# EAGLE design schemat (EAGLE 9.3.0)
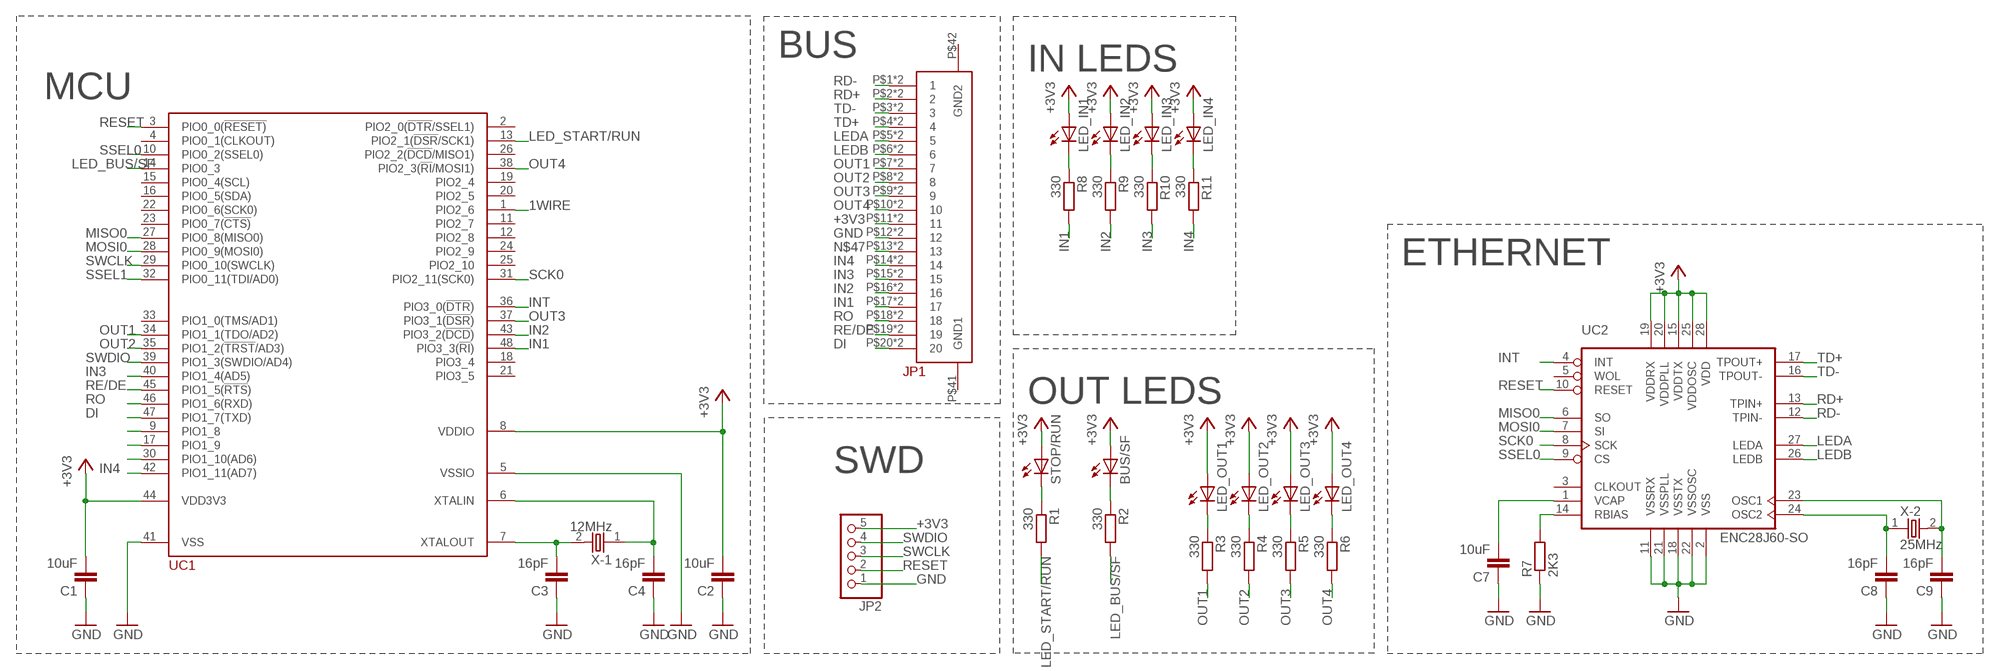
[diagram p0: schematic, sheet 1]

## Parts
BUS/SF  LED3MM  [LED3MM]
C1  10uF  C-0805  [C0805]
C2  10uF  C-0805  [C0805]
C3  16pF  C-0805  [C0805]
C4  16pF  C-0805  [C0805]
C7  10uF  C-0805  [C0805]
C8  16pF  C-0805  [C0805]
C9  16pF  C-0805  [C0805]
JP1  FFC(FPC)_ZIF_20_PINV  [PCA-2C-20-V-3]
JP2  PINHD-1X5  [1X05]
LED_IN1  LED3MM  [LED3MM]
LED_IN2  LED3MM  [LED3MM]
LED_IN3  LED3MM  [LED3MM]
LED_IN4  LED3MM  [LED3MM]
LED_OUT1  LED3MM  [LED3MM]
LED_OUT2  LED3MM  [LED3MM]
LED_OUT3  LED3MM  [LED3MM]
LED_OUT4  LED3MM  [LED3MM]
R1  330  R-0805W  [R0805W]
R2  330  R-0805W  [R0805W]
R3  330  R-0805W  [R0805W]
R4  330  R-0805W  [R0805W]
R5  330  R-0805W  [R0805W]
R6  330  R-0805W  [R0805W]
R7  2K3  R-0805  [R0805]
R8  330  R-0805W  [R0805W]
R9  330  R-0805W  [R0805W]
R10  330  R-0805W  [R0805W]
R11  330  R-0805W  [R0805W]
STOP/RUN  LED3MM  [LED3MM]
UC1  NXP-LPC111X  [LQFP48]
UC2  ENC28J60-SO  [SO28W]
X-1  12MHz  CRISTAL_SMD  [HC49UP]
X-2  25MHz  CRISTAL_SMD  [HC49UP]

## Nets
1WIRE: UC1.1(PIO2_6)
+3V3: BUS/SF.A C1.2 C2.2 JP1.P$11 JP1.P$31 JP2.5 LED_IN1.A LED_IN2.A LED_IN3.A LED_IN4.A LED_OUT1.A LED_OUT2.A LED_OUT3.A LED_OUT4.A STOP/RUN.A UC1.8(VDDIO) UC1.44(VDD3V3) UC2.15(VDDTX) UC2.19(VDDRX) UC2.20(VDDPLL) UC2.25(VDDOSC) UC2.28(VDD)
DI: JP1.P$20 JP1.P$40 UC1.47(PIO1_7(TXD))
GND: C1.1 C2.1 C3.1 C4.1 C7.1 C8.1 C9.1 JP1.P$12 JP1.P$32 JP2.1 R7.1 UC1.5(VSSIO) UC1.41(VSS) UC2.2(VSS) UC2.11(VSSRX) UC2.18(VSSTX) UC2.21(VSSPLL) UC2.22(VSSOSC)
IN1: JP1.P$17 JP1.P$37 R8.2 UC1.48(PIO3_3(!RI!))
IN2: JP1.P$16 JP1.P$36 R9.2 UC1.43(PIO3_2(!DCD!))
IN3: JP1.P$15 JP1.P$35 R10.2 UC1.40(PIO1_4(AD5))
IN4: JP1.P$14 JP1.P$34 R11.2 UC1.42(PIO1_11(AD7))
INT: UC1.36(PIO3_0(!DTR!)) UC2.4(INT)
LED_BUS/SF: R2.2 UC1.14(PIO0_3)
LED_START/RUN: R1.2 UC1.13(PIO2_1(!DSR!/SCK1))
LEDA: JP1.P$5 JP1.P$25 UC2.27(LEDA)
LEDB: JP1.P$6 JP1.P$26 UC2.26(LEDB)
MISO0: UC1.27(PIO0_8(MISO0)) UC2.6(SO)
MOSI0: UC1.28(PIO0_9(MOSI0)) UC2.7(SI)
N$1: C3.2 UC1.7(XTALOUT) X-1.2
N$2: C4.2 UC1.6(XTALIN) X-1.1
N$3: C8.2 UC2.24(OSC2) X-2.1
N$4: R1.1 STOP/RUN.K(C)
N$5: LED_IN4.K(C) R11.1
N$6: BUS/SF.K(C) R2.1
N$7: LED_OUT4.K(C) R6.1
N$8: LED_IN1.K(C) R8.1
N$9: LED_IN2.K(C) R9.1
N$10: LED_IN3.K(C) R10.1
N$11: LED_OUT3.K(C) R5.1
N$12: LED_OUT2.K(C) R4.1
N$13: LED_OUT1.K(C) R3.1
N$14: UC1.30(PIO1_10(AD6))
N$15: UC1.17(PIO1_9)
N$16: UC1.9(PIO1_8)
N$27: C9.2 UC2.23(OSC1) X-2.2
N$28: C7.2 UC2.1(VCAP)
N$30: R7.2 UC2.14(RBIAS)
N$47: JP1.P$13 JP1.P$33
OUT1: JP1.P$7 JP1.P$27 R3.2 UC1.34(PIO1_1(TDO/AD2))
OUT2: JP1.P$8 JP1.P$28 R4.2 UC1.35(PIO1_2(!TRST!/AD3))
OUT3: JP1.P$9 JP1.P$29 R5.2 UC1.37(PIO3_1(!DSR!))
OUT4: JP1.P$10 JP1.P$30 R6.2 UC1.38(PIO2_3(!RI!/MOSI1))
RD+: JP1.P$2 JP1.P$22 UC2.13(TPIN+)
RD-: JP1.P$1 JP1.P$21 UC2.12(TPIN-)
RE/DE: JP1.P$19 JP1.P$39 UC1.45(PIO1_5(!RTS!))
RESET: JP2.2 UC1.3(PIO0_0(!RESET)) UC2.10(RESET)
RO: JP1.P$18 JP1.P$38 UC1.46(PIO1_6(RXD))
SCK0: UC1.31(PIO2_11(SCK0)) UC2.8(SCK)
SSEL0: UC1.10(PIO0_2(SSEL0)) UC2.9(CS)
SSEL1: UC1.32(PIO0_11(TDI/AD0))
SWCLK: JP2.3 UC1.29(PIO0_10(SWCLK))
SWDIO: JP2.4 UC1.39(PIO1_3(SWDIO/AD4))
TD+: JP1.P$4 JP1.P$24 UC2.17(TPOUT+)
TD-: JP1.P$3 JP1.P$23 UC2.16(TPOUT-)
Unconnected: JP1.P$41(GND1) JP1.P$42(GND2) UC1.2(PIO2_0(!DTR!/SSEL1)) UC1.4(PIO0_1(CLKOUT)) UC1.11(PIO2_7) UC1.12(PIO2_8) UC1.15(PIO0_4(SCL)) UC1.16(PIO0_5(SDA)) UC1.18(PIO3_4) UC1.19(PIO2_4) UC1.20(PIO2_5) UC1.21(PIO3_5) UC1.22(PIO0_6(SCK0)) UC1.23(PIO0_7(!CTS)) UC1.24(PIO2_9) UC1.25(PIO2_10) UC1.26(PIO2_2(!DCD!/MISO1)) UC1.33(PIO1_0(TMS/AD1)) UC2.3(CLKOUT) UC2.5(WOL)

## Notes on the sheet
- BUS
- IN LEDS
- MCU
- ETHERNET
- OUT LEDS
- SWD

## Library data of the parts
BUS/SF LED_IN1-LED_IN4 LED_OUT1-LED_OUT4 STOP/RUN = led:LED: LED OSRAM: - CHIPLED LG R971, LG N971, LY N971, LG Q971, LY Q971, LO R971, LY R971 LH N974, LH R974 LS Q976, LO Q976, LY Q976 LO Q996 - Hyper CHIPLED LW Q18S LB Q993, LB Q99A, LB R99A - SideLED LS A670, LO A670, LY A670, LG A670, LP A670 LB A673, LV A673, LT A673, LW A673 LH A674 LY A675 LS A676, LA A676, LO A676, LY A676, LW A676 LS A679, LY A679, LG A679 - Hyper Micro SIDELED® LS Y876, LA Y876, LO Y876, LY Y876 LT Y87S - SmartLED LW L88C, LW L88S LB L89C, LB L89S, LG L890 LS L89K, LO L89K, LY L89K LS L896, LA L896, LO L896, LY L896 - TOPLED LS T670, LO T670, LY T670, LG T670, LP T670 LSG T670, LSP T670, LSY T670, LOP T670, LYG T670 LG T671, LOG T671, LSG T671 LB T673, LV T673, LT T673, LW T673 LH T674 LS T676, LA T676, LO T676, LY T676, LB T676, LH T676, LSB T676, LW T676 LB T67C, LV T67C, LT T67C, LS T67K, LO T67K, LY T67K, LW E67C LS E67B, LA E67B, LO E67B, LY E67B, LB E67C, LV E67C, LT E67C LW T67C LS T679, LY T679, LG T679 LS T770, LO T770, LY T770, LG T770, LP T770 LB T773, LV T773, LT T773, LW T773 LH T774 LS E675, LA E675, LY E675, LS T675 LS T776, LA T776, LO T776, LY T776, LB T776 LHGB T686 LT T68C, LB T68C - Hyper Mini TOPLED® LB M676 - Mini TOPLED Santana® LG M470 LS M47K, LO M47K, LY M47K Source: http://www.osram.convergy.de LUXEON: - LUMILED® LXK2-PW12-R00, LXK2-PW12-S00, LXK2-PW14-U00, LXK2-PW14-V00 LXK2-PM12-R00, LXK2-PM12-S00, LXK2-PM14-U00 LXK2-PE12-Q00, LXK2-PE12-R00, LXK2-PE12-S00, LXK2-PE14-T00, LXK2-PE14-U00 LXK2-PB12-K00, LXK2-PB12-L00, LXK2-PB12-M00, LXK2-PB14-N00, LXK2-PB14-P00, LXK2-PB14-Q00 LXK2-PR12-L00, LXK2-PR12-M00, LXK2-PR14-Q00, LXK2-PR14-R00 LXK2-PD12-Q00, LXK2-PD12-R00, LXK2-PD12-S00 LXK2-PH12-R00, LXK2-PH12-S00 LXK2-PL12-P00, LXK2-PL12-Q00, LXK2-PL12-R00 Source: www.luxeon.com KINGBRIGHT: KA-3528ASYC Source: www.kingbright.com
C1-C4 C7-C9 = devport001:C-0805: Kondensator SMD w obudowie 0805
JP1 = devport001:FFC(FPC)_ZIF_20_PIN
JP2 = pinhead:PINHD-1X5: PIN HEADER
R1-R11 = devport001:R-0805: Rezystor SMD w obudowie 0805
UC1 = devport001:NXP-LPC111X: NXP LPC111X
UC2 = enc28j60:ENC28J60-*: Microchip 10Mbit Ethernet controller with SPI interface Improved SOIC28 layout (pads in 0.01 raster, pin1 slightly smaller). Pin 6 (SO) changed from Out (paralleling several Outs gives an error) to OC. Author: Profi from mikrocontroller.net - forum Date: 2006.0827
X-1 X-2 = devport001:CRISTAL

## Board
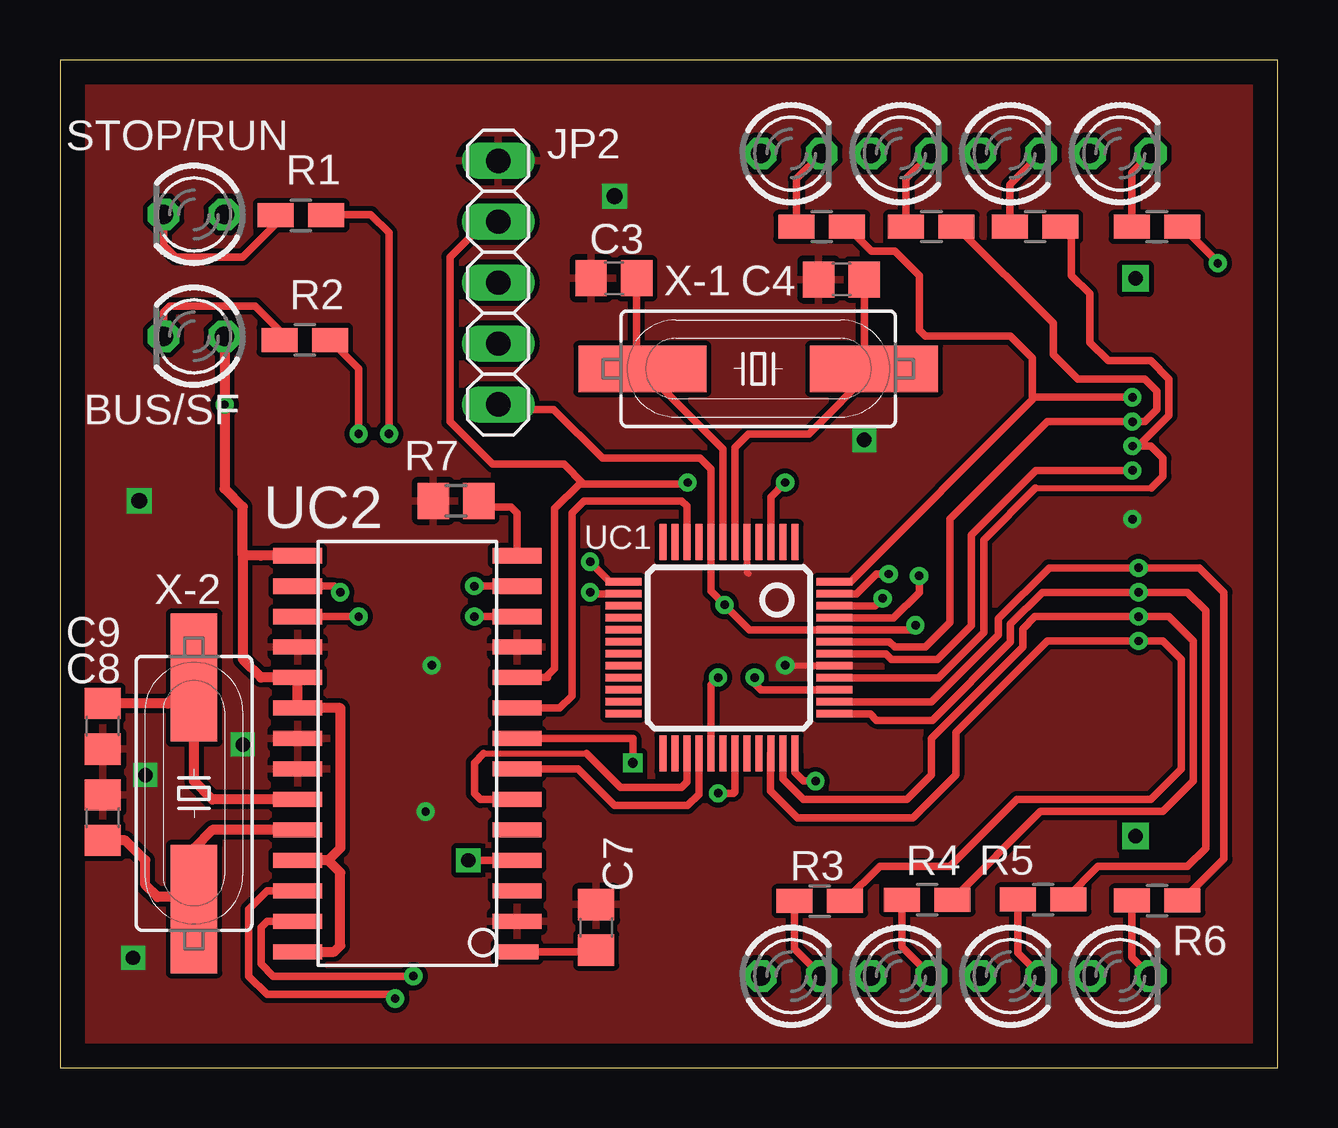
[diagram p1: board, top side]
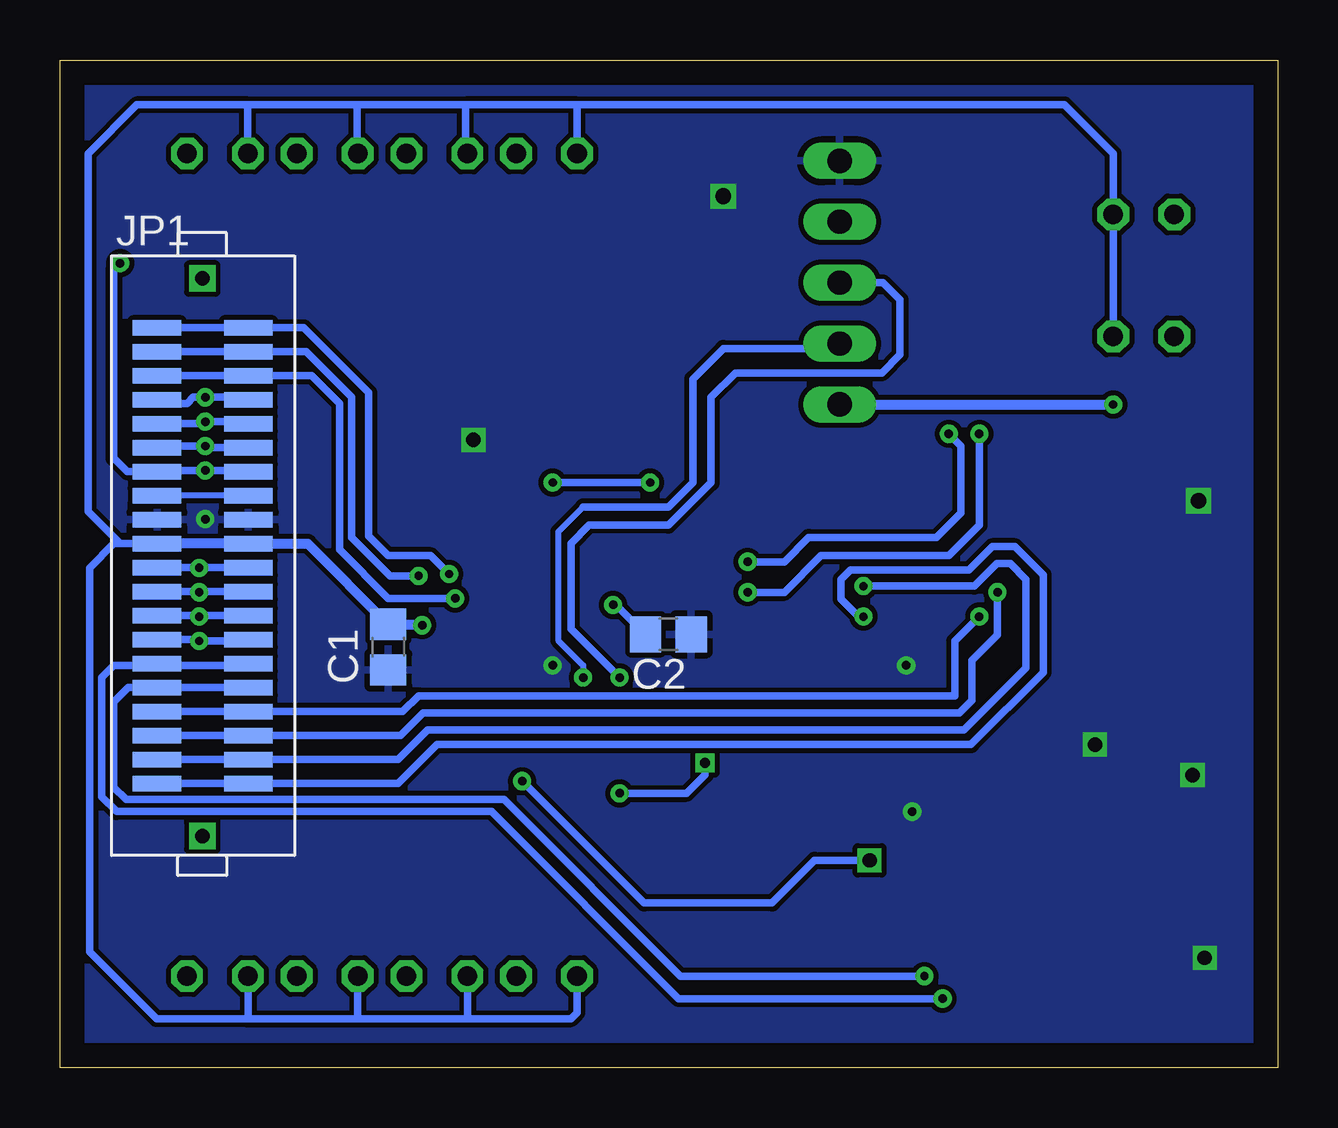
[diagram p2: board, bottom side, seen from below]

Size 50.76 x 42 mm. Coordinates in mm from the lower left corner, seen from the top.
Outline: 0,0 50.76,0 50.76,42 0,42 0,0
Copper layers (1*16): Top 0.035mm / dielectric 1.5mm / Bottom 0.035mm
Design rules "default *": minimum track width 10mil, minimum drill 0.35mm, track to track 8mil, track to pad 8mil, pad to pad 8mil, via to via 8mil, smd to smd 8mil, copper to edge 40mil, drill to drill 10mil, minimum pad ring 10mil, minimum via ring 8mil, stop-mask expansion 4mil, vias tented up to drill 0mil, thermal gap 10mil

### Footprints (pad centres in the part's own frame; a part is rotated, then mirrored left to right if it is on the bottom)
LED3MM = drill 0.813 octagon: A -1.27,0; K 1.27,0
C0805 = smd 1.3 x 1.5: 1 -0.95,0; 2 0.95,0
PCA-2C-20-V-3 = smd 2.032 x 0.635: P$1 -1.54,9.5; P$2 -1.54,8.5; P$3 -1.54,7.5; P$4 -1.54,6.5; P$5 -1.54,5.5; P$6 -1.54,4.5; P$7 -1.54,3.5; P$8 -1.54,2.5; P$9 -1.54,1.5; P$10 -1.54,0.5; P$11 -1.54,-0.5; P$12 -1.54,-1.5; P$13 -1.54,-2.5; P$14 -1.54,-3.5; P$15 -1.54,-4.5; P$16 -1.54,-5.5; P$17 -1.54,-6.5; P$18 -1.54,-7.5; P$19 -1.54,-8.5; P$20 -1.54,-9.5; P$21 2.27,9.5; P$22 2.27,8.5; P$23 2.27,7.5; P$24 2.27,6.5; P$25 2.27,5.5; P$26 2.27,4.5; P$27 2.27,3.5; P$28 2.27,2.5; P$29 2.27,1.5; P$30 2.27,0.5; P$31 2.27,-0.5; P$32 2.27,-1.5; P$33 2.27,-2.5; P$34 2.27,-3.5; P$35 2.27,-4.5; P$36 2.27,-5.5; P$37 2.27,-6.5; P$38 2.27,-7.5; P$39 2.27,-8.5; P$40 2.27,-9.5 | drill 0.6 square: P$41 0.381,11.684; P$42 0.381,-11.557
1X05 = drill 1.016 long: 1 -5.08,0; 2 -2.54,0; 3 0,0; 4 2.54,0; 5 5.08,0
R0805W = smd 1.5 x 1: 1 -1.052,0; 2 1.052,0
R0805 = smd 1.3 x 1.5: 1 -0.95,0; 2 0.95,0
LQFP48 = smd 0.3 x 1.5: 1 -2.75,-4.4; 2 -2.25,-4.4; 3 -1.75,-4.4; 4 -1.25,-4.4; 5 -0.75,-4.4; 6 -0.25,-4.4; 7 0.25,-4.4; 8 0.75,-4.4; 9 1.25,-4.4; 10 1.75,-4.4; 11 2.25,-4.4; 12 2.75,-4.4; 25 2.75,4.4; 26 2.25,4.4; 27 1.75,4.4; 28 1.25,4.4; 29 0.75,4.4; 30 0.25,4.4; 31 -0.25,4.4; 32 -0.75,4.4; 33 -1.25,4.4; 34 -1.75,4.4; 35 -2.25,4.4; 36 -2.75,4.4 | smd 1.5 x 0.3: 13 4.4,-2.75; 14 4.4,-2.25; 15 4.4,-1.75; 16 4.4,-1.25; 17 4.4,-0.75; 18 4.4,-0.25; 19 4.4,0.25; 20 4.4,0.75; 21 4.4,1.25; 22 4.4,1.75; 23 4.4,2.25; 24 4.4,2.75; 37 -4.4,2.75; 38 -4.4,2.25; 39 -4.4,1.75; 40 -4.4,1.25; 41 -4.4,0.75; 42 -4.4,0.25; 43 -4.4,-0.25; 44 -4.4,-0.75; 45 -4.4,-1.25; 46 -4.4,-1.75; 47 -4.4,-2.25; 48 -4.4,-2.75
SO28W = smd 0.635 x 1.778: 1 -7.62,-4.572 | smd 0.635 x 2.032: 2 -6.35,-4.572; 3 -5.08,-4.572; 4 -3.81,-4.572; 5 -2.54,-4.572; 6 -1.27,-4.572; 7 0,-4.572; 8 1.27,-4.572; 9 2.54,-4.572; 10 3.81,-4.572; 11 5.08,-4.572; 12 6.35,-4.572; 13 7.62,-4.572; 14 8.89,-4.572; 15 8.89,4.572; 16 7.62,4.572; 17 6.35,4.572; 18 5.08,4.572; 19 3.81,4.572; 20 2.54,4.572; 21 1.27,4.572; 22 0,4.572; 23 -1.27,4.572; 24 -2.54,4.572; 25 -3.81,4.572; 26 -5.08,4.572; 27 -6.35,4.572; 28 -7.62,4.572
HC49UP = smd 5.334 x 1.93: 1 -4.826,0; 2 4.826,0

### Placement (x,y rotation side)
BUS/SF  5.59,30.48 180 top
C1  37.08,17.53 90 bottom
C2  25.4,18.06 180 bottom
C3  23.09,32.9 0 top
C4  32.57,32.85 0 top
C7  22.35,5.84 270 top
C8  1.78,10.41 270 top
C9  1.78,14.22 90 top
JP1  44.45,21.34 180 bottom
JP2  18.27,32.72 270 top
LED_IN1  30.48,38.1 0 top
LED_IN2  35.05,38.1 0 top
LED_IN3  39.62,38.1 0 top
LED_IN4  44.2,38.1 0 top
LED_OUT1  30.48,3.81 0 top
LED_OUT2  35.05,3.81 0 top
LED_OUT3  39.62,3.81 0 top
LED_OUT4  44.2,3.81 0 top
R1  10.05,35.53 0 top
R2  10.2,30.32 0 top
R3  31.67,6.94 0 top
R4  36.15,7 0 top
R5  40.98,7.01 0 top
R6  45.73,6.96 0 top
R7  16.51,23.62 0 top
R8  31.75,35.05 0 top
R9  36.32,35.05 0 top
R10  40.64,35.05 0 top
R11  45.72,35.05 0 top
STOP/RUN  5.59,35.56 180 top
UC1  27.88,17.5 180 top
UC2  14.48,12.45 90 top
X-1  29.1,29.13 180 top
X-2  5.59,11.43 90 top

### Tracks (layer width: path | path; a pad name or v marks a point on that pad's centre or on a via)
+3V3  (via drill 0.35)
  Top 0.305: JP2.5 18.47,27.43 20.57,27.43 22.61,25.4 26.67,25.4 27.13,24.94 UC1.8 27.13,19.86 v27.7,19.29 28.74,18.25 UC1.44 35.47,18.25 v35.66,18.44
  Top 0.406: UC2.28 11.43,4.83 11.68,5.08 11.68,8.13 11.18,8.64 | 11.18,8.64 11.68,9.14 11.68,14.99 UC2.20 UC2.19 8.38,16.26 7.62,17.02 7.62,21.34 | 11.18,8.64 UC2.25 | UC2.15 8.38,21.34 7.62,21.34 | BUS/SF.A v6.86,27.63 6.86,24.13 7.62,23.37 7.62,21.34
  Bottom 0.305: BUS/SF.A STOP/RUN.A 6.86,38.1 8.89,40.13 29.16,40.13 29.21,40.13 | C2.2 27.58,19.29 v27.7,19.29 | JP1.P$31 48.26,21.84 | 48.26,21.84 48.52,21.84 49.53,20.83 49.53,4.83 46.74,2.03 43.02,2.03 | 38.29,2.03 33.74,2.03 | 43.02,2.03 38.29,2.03 | 33.74,2.03 29.46,2.03 29.21,2.29 LED_OUT1.A | LED_OUT2.A 33.78,2.08 33.74,2.03 | LED_OUT3.A 38.35,2.09 38.29,2.03 | LED_OUT4.A 42.93,2.13 43.02,2.03 | 48.26,21.84 49.59,23.17 49.59,38.1 47.56,40.13 42.94,40.13 | 38.37,40.13 33.85,40.13 | 42.94,40.13 38.37,40.13 | LED_IN2.A 33.85,38.17 33.85,40.13 | LED_IN3.A 38.37,38.12 38.37,40.13 | LED_IN4.A 42.94,38.12 42.94,40.13 | 29.21,40.13 33.85,40.13 | LED_IN1.A 29.21,40.13
  Bottom 0.406: JP2.5 v6.86,27.63 | JP1.P$31 JP1.P$11 40.44,21.84 C1.2 35.7,18.48 v35.66,18.44
DI  (via drill 0.35)
  Top 0.305: UC1.47 33.21,19.75 34.04,20.57 v34.54,20.57
  Bottom 0.305: v34.54,20.57 35.31,21.34 37.08,21.34 37.9,22.15 37.9,28.13 40.6,30.84 JP1.P$20 JP1.P$40
GND  (via drill 0.35, 0.6, 0.65)
  Top 0.254: UC1.41 30.24,16.75 v30.23,16.76 | UC1.5 28.63,20.64 28.7,20.57
  other vias: 3.3,23.62 23.11,36.32 3.56,12.19 7.62,13.46 33.53,26.16 3.05,4.57 15.49,16.76 15.24,10.67 44.7,22.86
  pour Top: -1.02,42.67 51.56,42.67 51.56,-1.02 -1.02,-1.02
  pour Bottom: -1.27,43.69 52.32,43.69 52.32,-2.03 -1.27,-2.03
IN1  (via drill 0.35)
  Top 0.305: UC1.48 32.95,20.25 40.54,27.84 40.54,27.94 | 40.54,27.94 v44.7,27.94 | R8.2 33.82,34.04 34.8,34.04 35.81,33.02 35.81,30.73 36.07,30.48 39.62,30.48 40.54,29.57 40.54,27.94
  Bottom 0.305: JP1.P$37 46.57,27.69 45.47,27.69 45.21,27.94 v44.7,27.94 43.01,27.94 JP1.P$17
IN2  (via drill 0.35)
  Top 0.305: R9.2 41.4,31.02 41.4,29.72 42.42,28.7 45.21,28.7 45.72,28.19 45.72,27.43 45.21,26.92 v44.7,26.92 41.15,26.92 37.08,22.86 37.08,18.54 36.07,17.53 34.8,17.53 34.58,17.75 UC1.43
  Bottom 0.305: JP1.P$36 44.79,26.84 v44.7,26.92 43,26.92 JP1.P$16
IN3  (via drill 0.35)
  Top 0.254: 40.66,24.15 45.49,24.15
  Top 0.305: R10.2 42.16,34.58 42.16,33.02 42.93,32.26 42.93,30.23 43.69,29.46 45.47,29.46 46.23,28.7 46.23,27.18 44.96,25.91 v44.7,25.91 45.47,25.91 45.97,25.4 45.97,24.64 45.49,24.15 | 40.66,24.15 38.5,21.99 38.5,18.14 36.61,16.25 UC1.40
  Bottom 0.305: JP1.P$15 44.63,25.84 v44.7,25.91 46.65,25.91 JP1.P$35
IN4  (via drill 0.35)
  Top 0.305: R11.2 48.26,33.56 v48.26,33.53 | UC1.42 34.43,17.25 34.66,17.02 36.58,17.02 37.99,18.44 37.99,22.2 40.68,24.89 v44.7,24.89 44.65,24.95
  Bottom 0.305: JP1.P$14 42.97,24.89 v44.7,24.89 46.66,24.89 JP1.P$34 47.95,24.84 48.51,25.4 48.51,33.27 v48.26,33.53
INT  (via drill 0.35, 0.6)
  Top 0.305: UC1.36 30.63,12.29 30.99,11.94 v31.5,11.94 | UC2.4 v17.02,8.64
  Bottom 0.305: v17.02,8.64 19.3,8.64 21.08,6.86 26.42,6.86 v31.5,11.94
LED_BUS/SF  (via drill 0.35)
  Top 0.305: UC1.14 22.16,19.75 v22.1,19.81 | v12.45,26.42 12.45,29.13 R2.2
  Bottom 0.305: v22.1,19.81 20.57,19.81 19.05,21.34 13.72,21.34 12.45,22.61 v12.45,26.42
LED_START/RUN  (via drill 0.35)
  Top 0.305: UC1.13 22.93,20.25 v22.1,21.08 | v13.72,26.42 13.72,34.8 12.95,35.56 11.13,35.56 R1.2
  Bottom 0.305: v22.1,21.08 20.57,21.08 19.56,22.1 14.22,22.1 13.21,23.11 13.21,25.91 v13.72,26.42
LEDA  (via drill 0.35)
  Top 0.305: UC2.27 8.64,6.1 8.38,5.84 8.38,4.32 8.89,3.81 v14.73,3.81
  Bottom 0.305: v14.73,3.81 24.89,3.81 32.26,11.18 48.01,11.18 48.51,11.68 48.51,15.24 47.92,15.84 46.87,15.84 | 46.87,15.84 JP1.P$25 | JP1.P$5 46.87,15.84
LEDB  (via drill 0.35)
  Top 0.305: UC2.26 8.64,7.37 7.87,6.6 7.87,3.81 8.64,3.05 13.79,3.05 v13.97,2.87
  Bottom 0.305: v13.97,2.87 24.97,2.87 32.77,10.67 48.4,10.67 49.02,11.29 49.02,16.26 48.51,16.76 46.79,16.76 | 46.79,16.76 JP1.P$26 | JP1.P$6 42.98,16.76 46.79,16.76
MISO0
  Top 0.254: 17.67,13.09 21.96,13.09
  Top 0.305: UC1.27 26.13,11.91 25.91,11.68 23.37,11.68 21.96,13.09 | UC2.6 17.53,11.18 17.27,11.43 17.27,12.7 17.67,13.09
MOSI0
  Top 0.305: UC1.28 26.63,11.39 26.16,10.92 23.11,10.92 21.59,12.45 UC2.7
N$1
  Top 0.305: UC1.7 27.63,25.77 X-1.2 24.04,29.37 C3.2
N$2
  Top 0.305: UC1.6 28.13,25.85 28.7,26.42 31.22,26.42 X-1.1 33.52,29.54 C4.2
N$3
  Top 0.406: UC2.24 6.35,9.91 5.59,9.14 X-2.1 5.08,7.11 4.06,7.11 3.56,7.62 3.56,8.64 2.73,9.46 C8.2
N$4
  Top 0.305: R1.1 8.99,35.16 7.62,33.78 4.83,33.78 4.32,34.29 STOP/RUN.K
N$5
  Top 0.305: LED_IN4.K 44.67,37.3 R11.1
N$6
  Top 0.305: R2.1 9.15,30.73 8.13,31.75 4.57,31.75 4.32,31.5 BUS/SF.K
N$7
  Top 0.305: LED_OUT4.K 44.68,4.6 R6.1
N$8
  Top 0.305: LED_IN1.K 30.7,37.05 R8.1
N$9
  Top 0.305: LED_IN2.K 35.27,37.05 R9.1
N$10
  Top 0.305: LED_IN3.K 39.59,36.79 R10.1
N$11
  Top 0.305: LED_OUT3.K 39.93,4.77 R5.1
N$12
  Top 0.305: LED_OUT2.K 35.1,5.04 R4.1
N$13
  Top 0.305: LED_OUT1.K 30.62,4.94 R3.1
N$27
  Top 0.406: UC2.23 6.35,11.18 5.59,11.94 X-2.2 4.51,15.17 C9.2
N$28
  Top 0.305: UC2.1 21.91,4.83 C7.2
N$30
  Top 0.305: UC2.14 19.05,23.11 18.8,23.37 17.71,23.37 R7.2
N$47
  Bottom 0.254: JP1.P$13 JP1.P$33
OUT1  (via drill 0.35)
  Top 0.305: R3.2 34.17,8.38 37.08,8.38 39.88,11.18 45.47,11.18 46.74,12.45 46.74,17.02 45.97,17.78 v44.96,17.78 41.15,17.78 37.34,13.97 37.34,12.19 35.56,10.41 30.73,10.41 29.62,11.52 29.62,13.09 UC1.34
  Bottom 0.305: JP1.P$27 45.01,17.84 v44.96,17.78 42.97,17.78 JP1.P$7
OUT2  (via drill 0.35)
  Top 0.305: R4.2 40.87,10.67 45.97,10.67 47.24,11.94 47.24,17.78 46.23,18.8 v44.96,18.8 40.64,18.8 40.13,18.29 40.13,17.53 36.32,13.72 36.32,12.19 35.31,11.18 30.99,11.18 30.13,12.03 UC1.35
  Bottom 0.305: 45,18.84 v44.96,18.8 | 45,18.84 JP1.P$28 | JP1.P$8 45,18.84
OUT3  (via drill 0.35)
  Top 0.305: R5.2 41.97,7.08 43.27,8.38 46.99,8.38 47.75,9.14 47.75,19.05 46.99,19.81 v44.96,19.81 40.94,19.81 39.62,18.5 39.62,17.74 36.37,14.48 34.04,14.48 33.78,14.73 32.3,14.73 UC1.37
  Bottom 0.305: 44.98,19.84 v44.96,19.81 | 44.98,19.84 JP1.P$29 | JP1.P$9 44.98,19.84
OUT4  (via drill 0.35)
  Top 0.305: R6.2 48.51,8.7 48.51,19.81 47.5,20.83 v44.96,20.83 41.23,20.83 39.12,18.71 39.12,18.03 36.32,15.24 UC1.38
  Bottom 0.305: v44.97,20.84 v44.96,20.83 | v44.97,20.84 JP1.P$30 | JP1.P$10 v44.97,20.84
RD+  (via drill 0.35)
  Top 0.305: v17.27,20.07 UC2.13
  Bottom 0.305: v17.27,20.07 12.65,20.07 11.71,21 11.15,21 10.49,20.35 10.49,16.66 13.08,14.07 35.44,14.07 36.67,12.84 JP1.P$2 JP1.P$22
RD-  (via drill 0.35)
  Top 0.305: v17.27,18.8 UC2.12
  Bottom 0.305: v17.27,18.8 17.48,18.8 18.21,19.53 18.21,20.35 17.81,20.75 12.87,20.75 11.9,21.71 10.96,21.71 9.78,20.54 9.78,16.47 12.79,13.46 35.05,13.46 36.68,11.84 JP1.P$1 JP1.P$21
RE/DE  (via drill 0.35)
  Top 0.305: UC1.45 34.75,18.75 35.81,19.81 v35.81,20.5
  Bottom 0.305: v35.81,20.5 37.01,20.5 38.61,22.1 38.61,27.94 40.5,29.84 JP1.P$19 JP1.P$39
RESET  (via drill 0.35)
  Top 0.305: UC2.10 20.32,16.26 20.32,16.33 20.62,16.64 20.62,23.3 21.66,24.33 21.82,24.33 | v26.16,24.38 25.86,24.33 21.82,24.33 | v30.23,24.38 29.63,23.79 UC1.3 | JP2.2 17.73,35.26 16.26,33.78 16.26,26.92 18.03,25.15 21.01,25.15 21.82,24.33
  Bottom 0.305: v30.23,24.38 v26.16,24.38
RO  (via drill 0.35)
  Top 0.305: UC1.46 33.98,19.25 v34.29,19.56
  Bottom 0.305: v34.29,19.56 37.08,19.56 39.12,21.59 39.12,27.69 40.27,28.84 JP1.P$18 JP1.P$38
SCK0  (via drill 0.35, 0.4)
  Top 0.305: UC1.31 28.13,11.49 28.07,11.43 v27.43,11.43 | v23.88,12.7 23.88,13.72 UC2.8
  Bottom 0.305: v27.43,11.43 24.64,11.43 23.88,12.19 v23.88,12.7
SSEL0
  Top 0.305: UC2.9 20.83,14.99 21.34,15.49 21.34,23.11 21.84,23.62 25.91,23.62 26.13,23.4 UC1.10
SWCLK  (via drill 0.35)
  Top 0.305: v27.43,16.26 27.13,15.96 UC1.29
  Bottom 0.305: JP2.3 16.46,32.72 15.75,32 15.75,29.72 16.51,28.96 22.61,28.96 23.62,27.94 23.62,24.38 25.4,22.61 28.7,22.61 29.46,21.84 29.46,18.29 v27.43,16.26
SWDIO  (via drill 0.35)
  Top 0.305: UC1.39 29.21,15.75 28.96,16 v28.96,16.26
  Bottom 0.254: 28.96,23.37 30,22.33 30,17.8 28.96,16.76 v28.96,16.26
  Bottom 0.305: 28.96,23.37 25.4,23.37 24.38,24.38 24.38,28.7 23.11,29.97 18.47,29.97 JP2.4
TD+  (via drill 0.35)
  Top 0.305: v12.45,18.8 UC2.17
  Bottom 0.305: v12.45,18.8 13.46,17.78 13.46,15.49 35.81,15.49 36.47,14.84 JP1.P$4 JP1.P$24
TD-  (via drill 0.35)
  Top 0.305: v11.68,19.81 11.43,20.07 UC2.16
  Bottom 0.305: JP1.P$23 JP1.P$3 36.57,13.84 35.62,14.78 13.27,14.78 12.75,15.3 12.75,16.97 11.68,18.03 v11.68,19.81

### Text on the board
tValues: MCU v3.0 (D.K.)